# EAGLE design Simple-Transmitter-2SC9014 (EAGLE 7.6.0)
Simple FM Transmitter with Electret Microphone, based on NPN Transistor
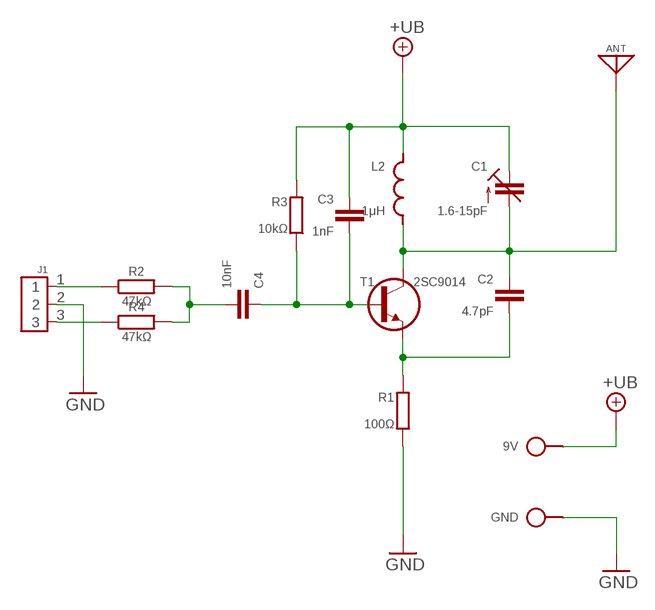
[diagram p0: schematic, sheet 1]

## Parts
9V  SPAD  [SPAD]
ANT  ANT  [SPAD]
C1  1.6-15pF  C-TR-PH201272222-808-2PINB  [TRIM-2222-808]
C2  4.7pF  C025-015X024  [C025-015X024]
C3  1nF  C025-015X024  [C025-015X024]
C4  10nF  C050-020X036/V  [C050-020X036/V]
GND  SPAD  [SPAD]
J1  CONN-3P-3P  [CONN-3P]
L2  1μH  L-SHORT04/7  [L-04/7]
R1  100Ω  R0204/2V  [0204/2V]
R2  47kΩ  R-H0204/10-V  [0204/10-V]
R3  10kΩ  R0204/10-V  [0204/10-V]
R4  47kΩ  R-H0204/10-V  [0204/10-V]
T1  2SC9014  [TO92-EBC]

## Nets
+UB: 9V.1 C1.3(E) C3.1 L2.2 R3.1
GND: GND.1 J1.2 R1.1
N$1: J1.3 R4.1
N$2: ANT.1 C1.2(A) C2.1 L2.1 T1.C
N$3: C2.2 R1.2 T1.E
N$4: J1.1 R2.1
N$5: C3.2 C4.1 R3.2 T1.B
N$6: C4.2 R2.2 R4.2

## Library data of the parts
9V GND = pad:SPAD
ANT = pad:ANT
C1 = cap-trim:C-TR-PH20127
C2-C4 = c:C: CAPACITOR, European symbol
J1 = pinconn:CONN-3P
L2 = l:L-SHORT
R1 R3 = r:R: RESISTOR, European symbol
R2 R4 = r:R-H
T1 = t:2SC9014

## Net classes
0 default: width 0.61 mm

## Board
Simple FM Transmitter with Electret Microphone, based on NPN Transistor
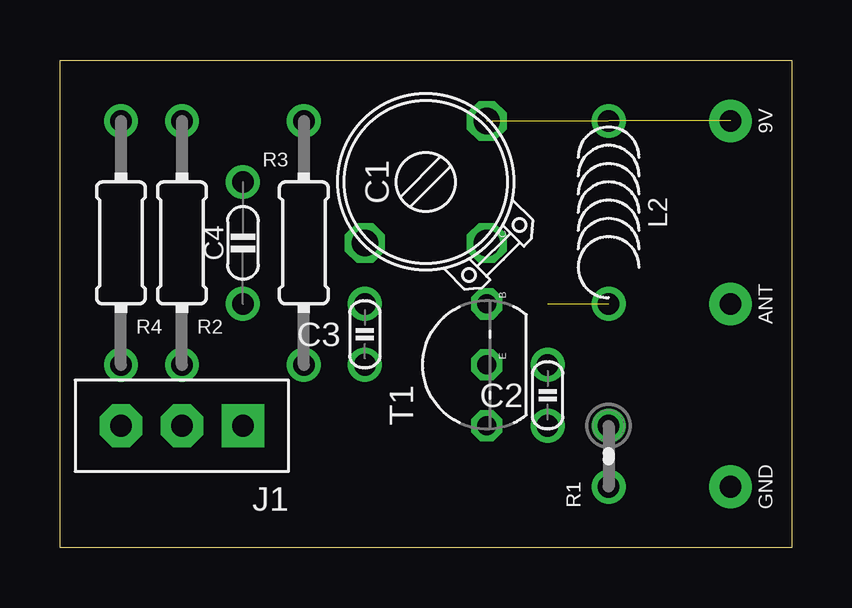
[diagram p1: board, top side]
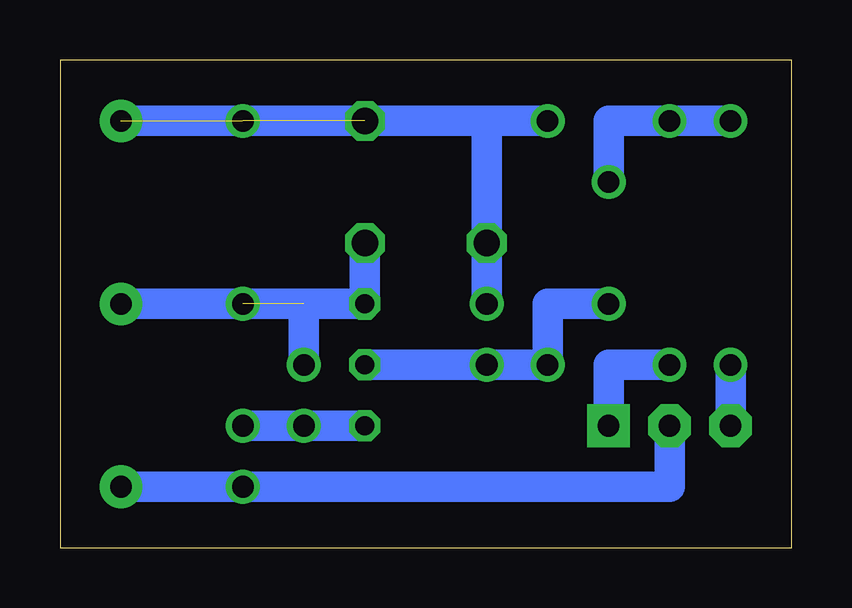
[diagram p2: board, bottom side, seen from below]

Size 30.48 x 20.32 mm. Coordinates in mm from the lower left corner, seen from the top.
Outline: 30.48,0 0,0 0,20.32 30.48,20.32 30.48,0
Copper layers (1*16): Top 0.035mm / dielectric 1.5mm / Bottom 0.035mm
Design rules "default": minimum track width 10mil, minimum drill 24mil, track to track 8mil, track to pad 8mil, pad to pad 8mil, via to via 8mil, smd to smd 8mil, copper to edge 40mil, drill to drill 8mil, minimum pad ring 10mil, minimum via ring 8mil, stop-mask expansion 4mil, vias tented up to drill 0mil, thermal gap 10mil

### Footprints (pad centres in the part's own frame; a part is rotated, then mirrored left to right if it is on the bottom)
SPAD = drill 0.9 pad 1.778: 1 0,0
TRIM-2222-808 = drill 1.1 octagon: 1 -2.54,2.54; 2 -2.54,-2.54; 3 2.54,-2.54
C025-015X024 = drill 0.9: 1 0,1.27; 2 0,-1.27
C050-020X036/V = drill 0.9: 1 0,-2.54; 2 0,2.54
CONN-3P = drill 0.9 pad 1.778 square: 1 0,0 | drill 0.9 pad 1.778 octagon: 2 2.54,0; 3 5.08,0
L-04/7 = drill 0.9: 1 3.81,0; 2 -3.81,0
0204/2V = drill 0.9: 1 -1.27,0; 2 1.27,0
0204/10-V = drill 0.9: 1 0,5.08; 2 0,-5.08
TO92-EBC = drill 0.8 octagon: B 0,-1.27; C 2.54,-1.27; E -2.54,-1.27

### Placement (x,y rotation side)
9V  27.94,17.78 180 top
ANT  27.94,10.16 180 top
C1  15.24,15.24 90 top
C2  20.32,6.35 0 top
C3  12.7,8.89 0 top
C4  7.62,12.7 0 top
GND  27.94,2.54 180 top
J1  7.62,5.08 180 top
L2  22.86,13.97 270 top
R1  22.86,3.81 90 top
R2  5.08,12.7 180 top
R3  10.16,12.7 0 top
R4  2.54,12.7 180 top
T1  16.51,7.62 90 top

### Tracks (layer width: path | path; a pad name or v marks a point on that pad's centre or on a via)
+UB  (2 unrouted)
  Bottom 1.27: C3.1 12.7,17.78 | 12.7,17.78 9V.1 | R3.1 12.7,17.78
GND
  Bottom 1.27: J1.2 5.08,2.54 R1.1 GND.1
N$1
  Bottom 1.27: J1.3 R4.1
N$2  (1 unrouted)
  Bottom 1.27: ANT.1 20.32,10.16 | 20.32,10.16 T1.C C1.2 | 20.32,10.16 C2.1
N$3
  Bottom 1.27: T1.E C2.2 R1.2
N$4
  Bottom 1.27: J1.1 7.62,7.62 R2.1
N$5
  Bottom 1.27: T1.B C3.2 R3.2 10.16,10.16 C4.1
N$6
  Bottom 1.27: C4.2 7.62,17.78 R2.2 R4.2